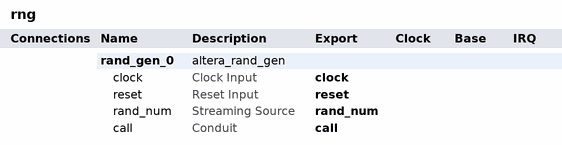
[diagram p0: system contents]
# Platform Designer (Qsys) system rng, Cyclone V 5CSEMA5F31C6
# Parameters at their usual value, and those the tool derives, are not listed.
package require -exact qsys 19.1
create_system rng
set_project_property DEVICE_FAMILY {Cyclone V}
set_project_property DEVICE 5CSEMA5F31C6

add_instance rand_gen_0 altera_rand_gen 19.1
set_instance_property rand_gen_0 AUTO_EXPORT true
set_instance_parameter_value rand_gen_0 GEN_TYPE 3
set_instance_parameter_value rand_gen_0 IS_TESTING false
set_instance_parameter_value rand_gen_0 MODEL_OPTION 2
set_instance_parameter_value rand_gen_0 SEED_GEN Auto
set_instance_parameter_value rand_gen_0 SEED_VALUE 68997764
set_instance_parameter_value rand_gen_0 design_env NATIVE
set_instance_parameter_value rand_gen_0 selected_device_family {Cyclone V}

# exported interfaces
add_interface call conduit end
set_interface_property call EXPORT_OF rand_gen_0.call
add_interface clock clock sink
set_interface_property clock EXPORT_OF rand_gen_0.clock
add_interface rand_num avalon_streaming source
set_interface_property rand_num EXPORT_OF rand_gen_0.rand_num
add_interface reset reset sink
set_interface_property reset EXPORT_OF rand_gen_0.reset

set_interconnect_requirement {$system} qsys_mm.clockCrossingAdapter HANDSHAKE
set_interconnect_requirement {$system} qsys_mm.enableEccProtection FALSE
set_interconnect_requirement {$system} qsys_mm.insertDefaultSlave FALSE
set_interconnect_requirement {$system} qsys_mm.maxAdditionalLatency 1

save_system rng.qsys
